# Altium schematic sheet [XX] - DOC REVISION HISTORY.SchDoc
size A3; DocumentNumber: 3; SheetNumber: 9; SheetTotal: 9
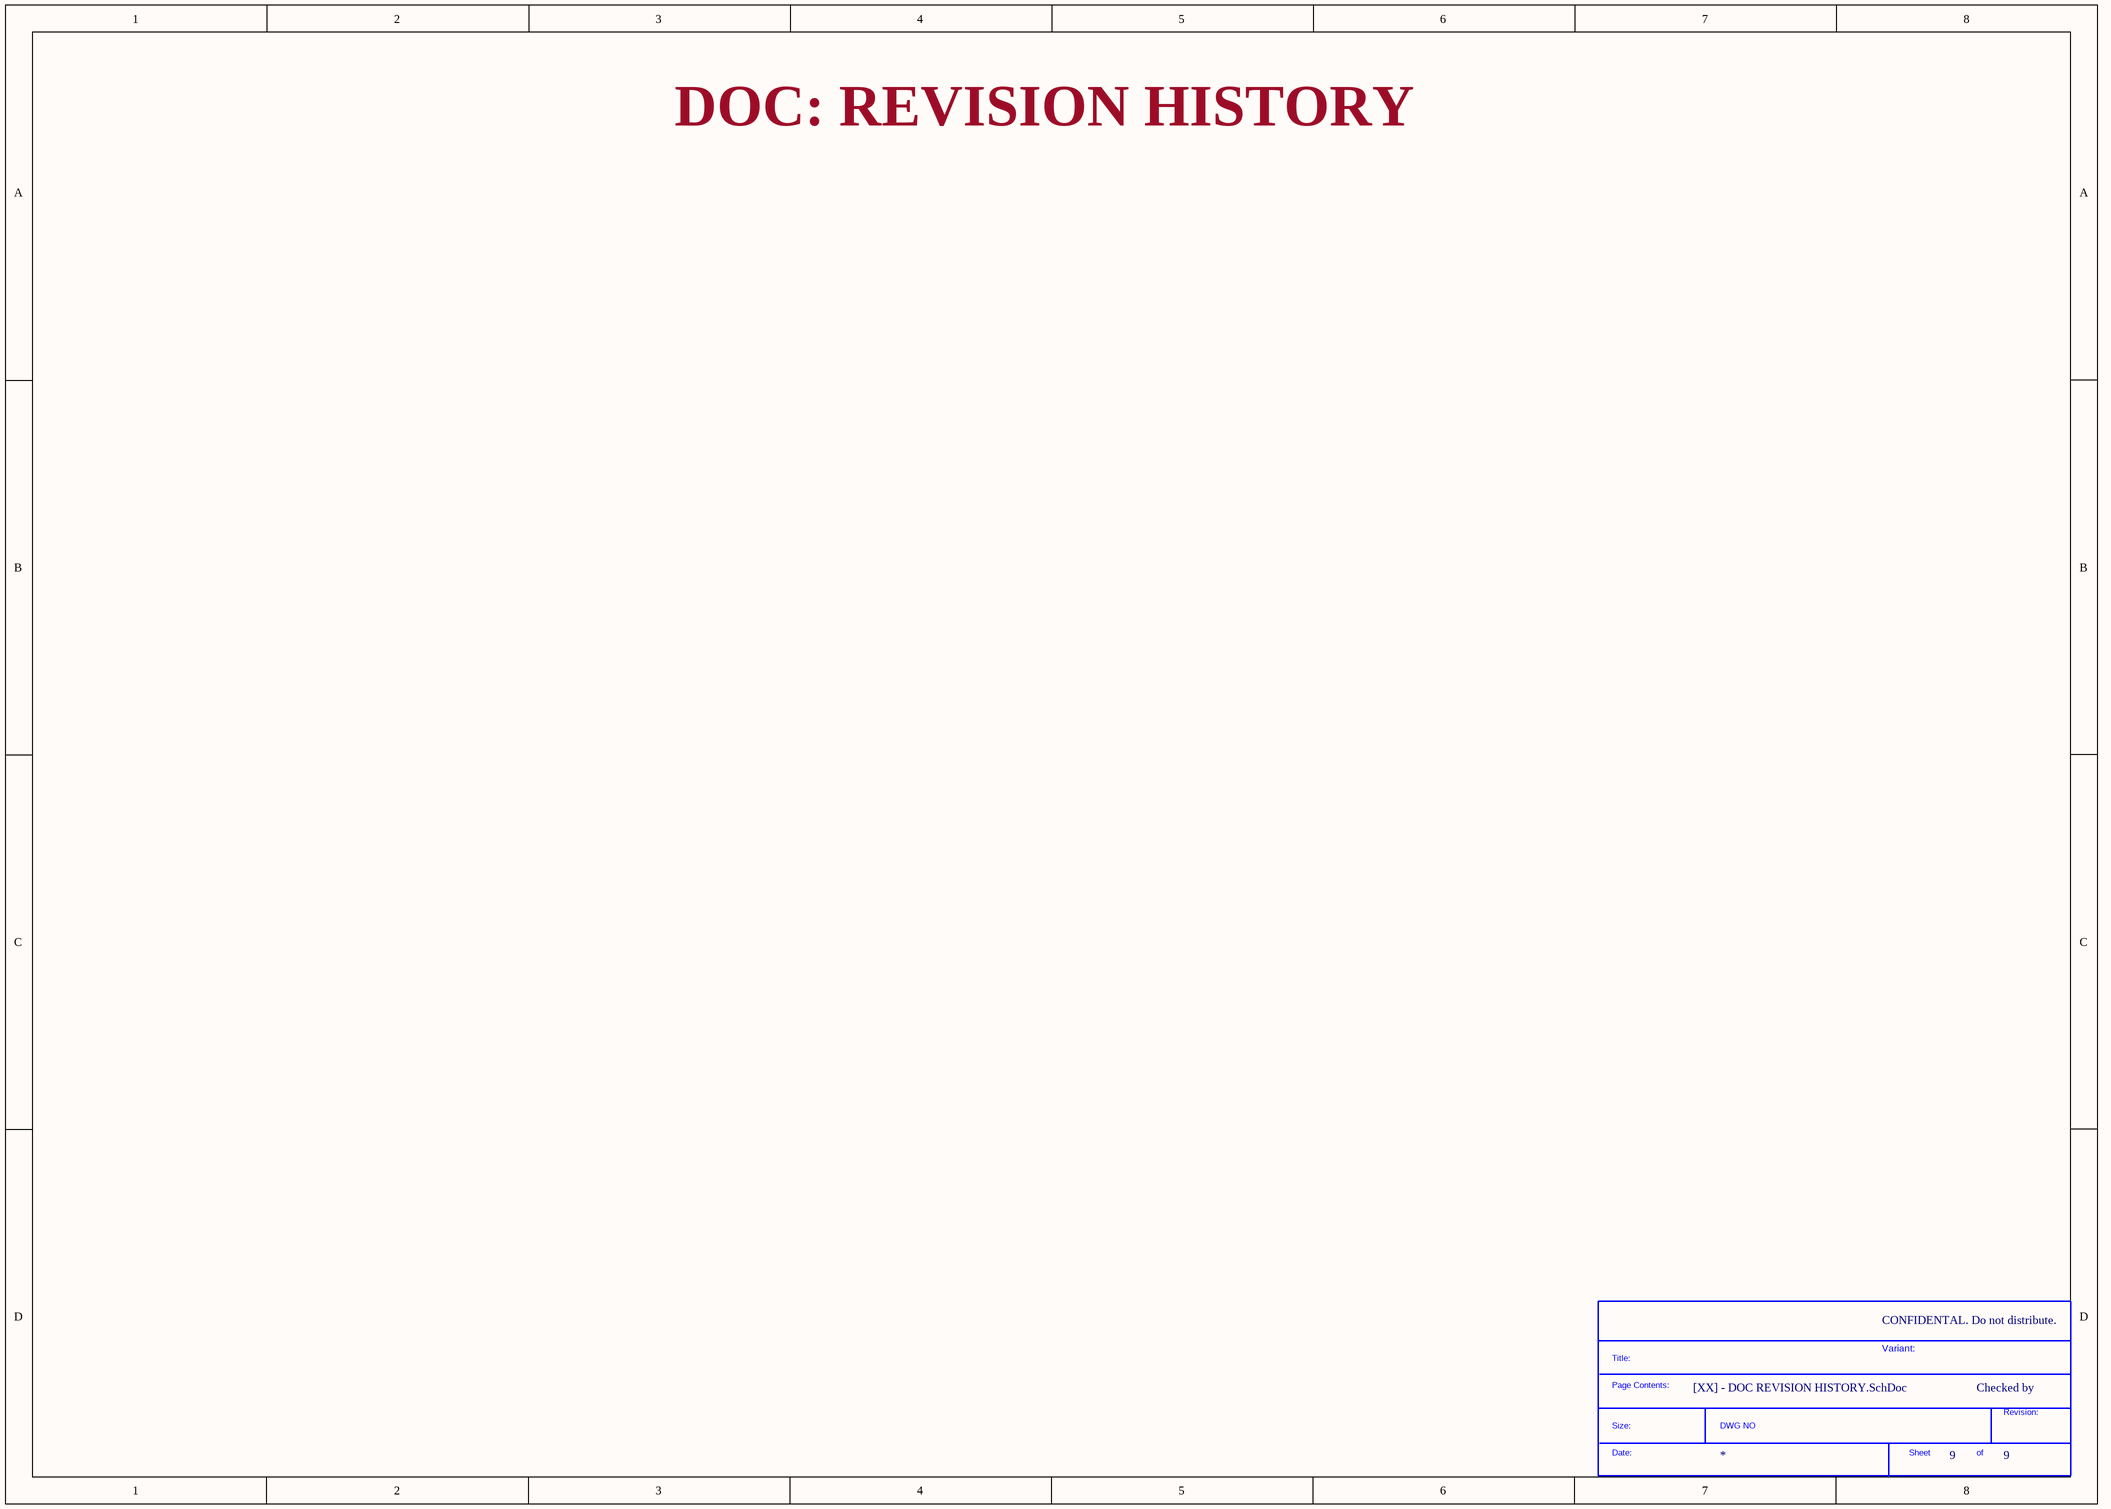
[diagram p0: [XX] - DOC REVISION HISTORY.SchDoc]

## Parts
*  SDTitleBlock  (value not drawn)  (graphical)

## Notes on the sheet
- DOC: REVISION HISTORY
- CONFIDENTAL. Do not distribute.
- CLOCKS (CPU & PCIE)
- Variant:
- Checked by
- (in symbol SDTitleBlock) Title:; Page Contents:; Revision:; Size:; DWG NO; Date:; Sheet; of